# Altium schematic sheet adder_4bit.SchDoc
size A4
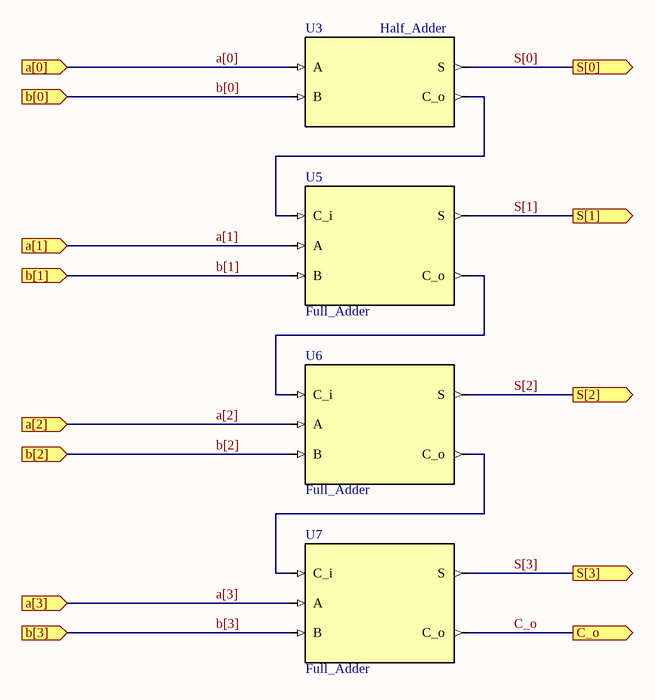
[diagram p0: adder_4bit.SchDoc]

## Parts
U3  Half_Adder
U5  Full_Adder
U6  Full_Adder
U7  Full_Adder

## Ports
a[0] (in), a[1] (in), a[2] (in), a[3] (in), b[0] (in), b[1] (in), b[2] (in), b[3] (in), C_o (out), S[0] (out), S[1] (out), S[2] (out), S[3] (out)

## Nets
a[0]: U3.A ; port a[0]
a[1]: U5.A ; port a[1]
a[2]: U6.A ; port a[2]
a[3]: U7.A ; port a[3]
b[0]: U3.B ; port b[0]
b[1]: U5.B ; port b[1]
b[2]: U6.B ; port b[2]
b[3]: U7.B ; port b[3]
C_o: U7.C_O(C_o) ; port C_o
S[0]: U3.S ; port S[0]
S[1]: U5.S ; port S[1]
S[2]: U6.S ; port S[2]
S[3]: U7.S ; port S[3]
NetU3_C_O: U3.C_O(C_o) U5.C_i
NetU5_C_O: U5.C_O(C_o) U6.C_i
NetU6_C_O: U6.C_O(C_o) U7.C_i

## Library data of the parts
U3 = Half_Adder_BS
U5-U7 = Full_Adder_BS